# Altium schematic sheet TCMT11071_TCMT1107.schdoc
size 124 x 101 mm
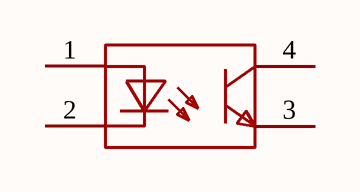
[diagram p0: TCMT11071_TCMT1107.schdoc]

## Parts
U?  TCMT1107  [SOP-4_L4.4-W2.8-P1.27-LS7.0-TL]  (value not drawn)

## Nets

Not connected (* = marked no-connect by the designer): U? 1(AN) 2(CAT) 3(EM) 4(COL)

## Library data of the parts
U? = TCMT1107: Manufacturer: VISHAY(威世); Add into BOM: yes; Input voltage type: DC; Output Type: 光电三极管; Forward Voltage: 1.35V; Output Current: 50mA; Isolation Voltage(rms): 3.75kV; Reverse Voltage: 6V; Receiving End Voltage: 70V; Number of Outputs: 1; Collector-Emitter Saturation Voltage (Vce(sat)@Ic,IF): 300mV@1mA,10mA; Rise time: 5.5us@2mA,100Ω; Fall time: 7us@2mA,100Ω; Symbol: TCMT1107; Device: TCMT1107; LCSC Part Name: DC输入 隔离电压(rms):3750V; Supplier Part: C81148; Manufacturer Part: TCMT1107; Supplier Footprint: SOP-4-1.27mm; JLCPCB Part Class: Extended Part; Datasheet: https://atta.szlcsc.com/upload/public/pdf/source/20170713/C118299_1499918878383816727.pdf; Supplier: LCSC; Convert to PCB: yes; Operating Temperature: -40℃~+100℃